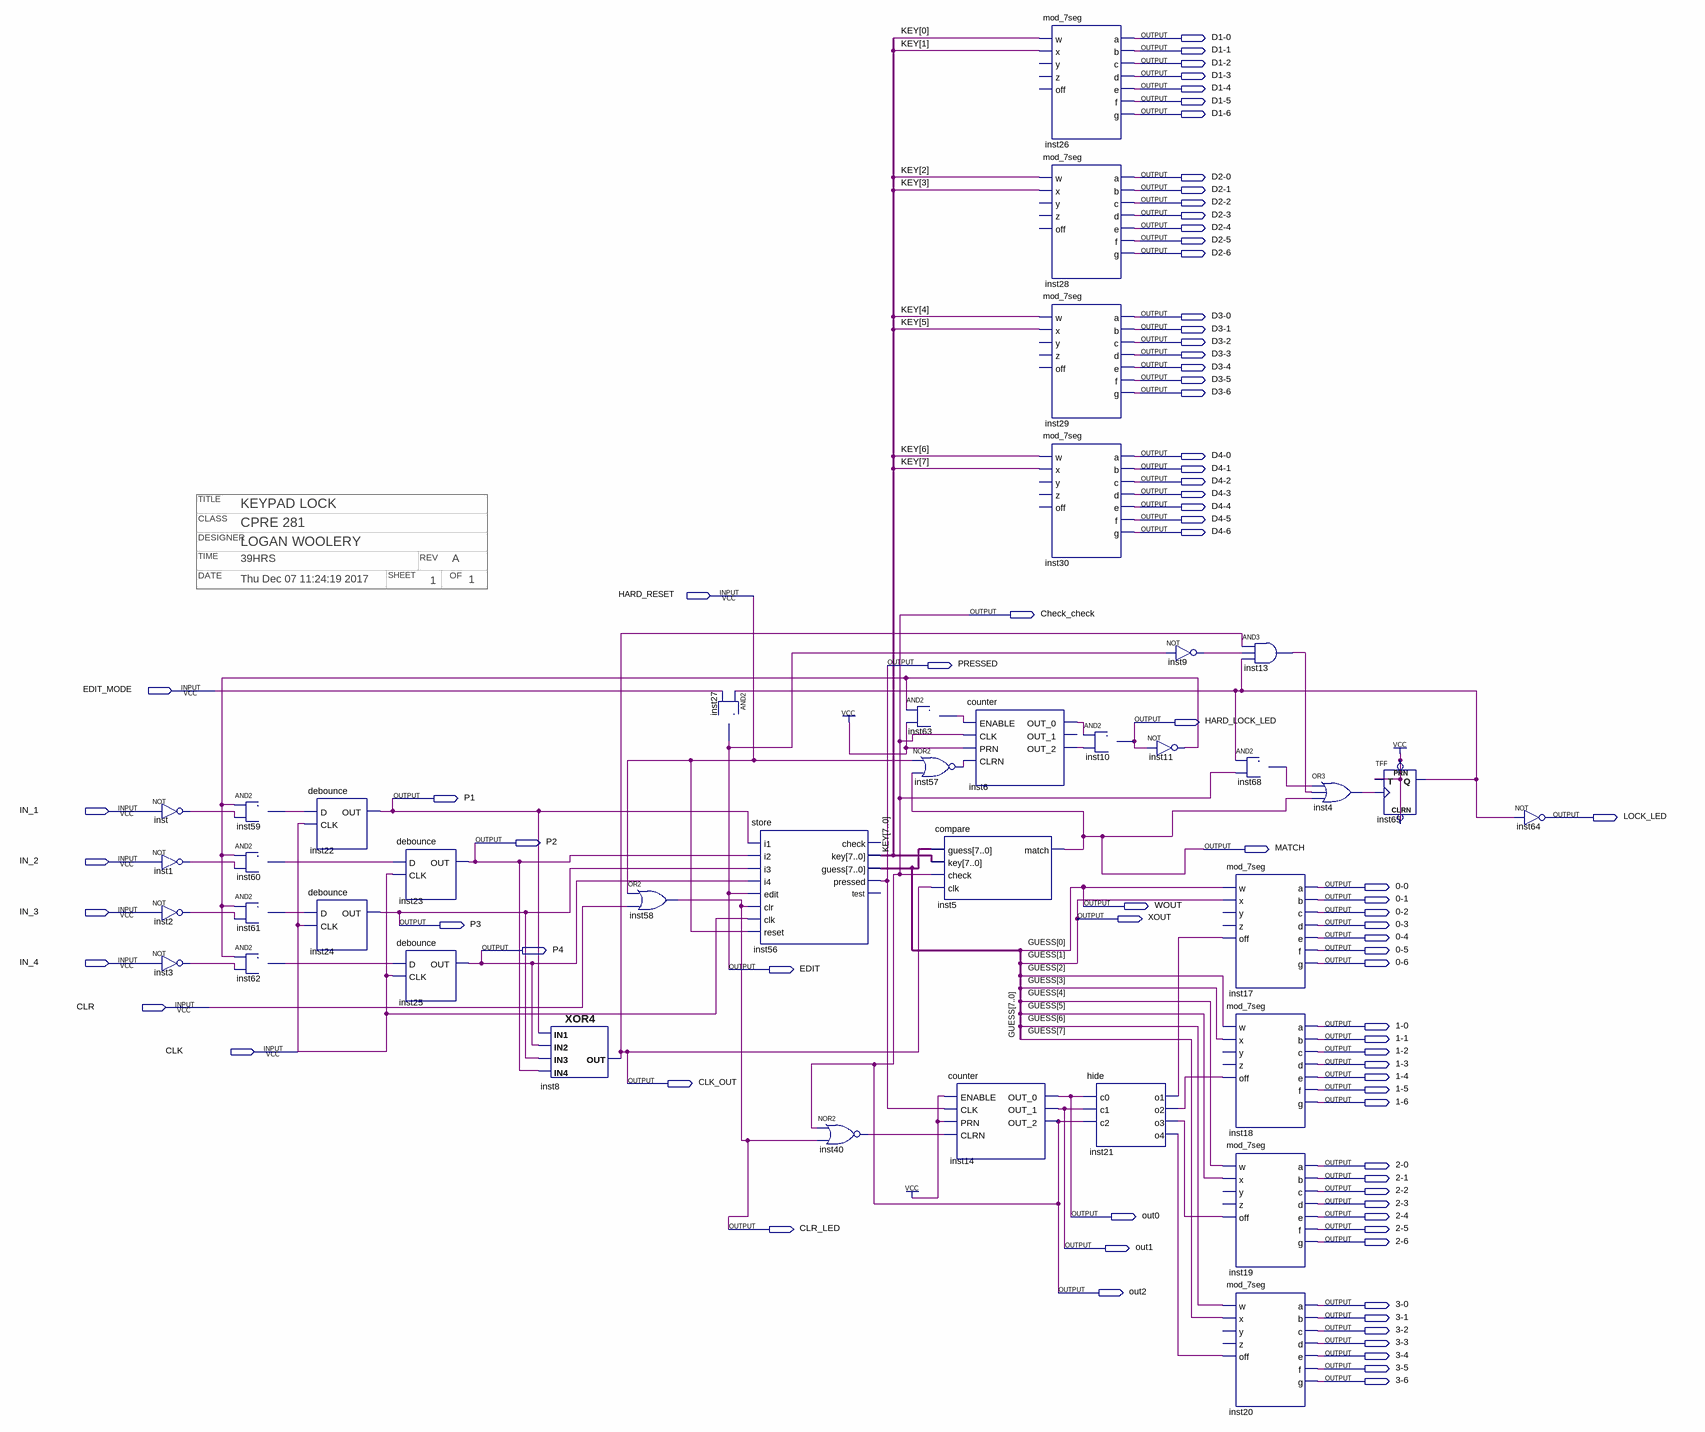
[diagram p0: schematic sheet]
// Quartus schematic round2.bdf as structural Verilog: 39 symbols, 81 pins
// Title block: CLASS: CPRE 281; DATE: Thu Dec 07 11:24:19 2017; DESIGNER: LOGAN WOOLERY; OF: 1; REV: A; SHEET: 1; TIME: 39HRS; TITLE: KEYPAD LOCK
module round2 (
  input  HARD_RESET,
  input  EDIT_MODE,
  input  IN_1,
  input  IN_2,
  input  IN_3,
  input  IN_4,
  input  CLR,
  input  CLK,
  output \D1-0 ,
  output \D1-1 ,
  output \D1-2 ,
  output \D1-3 ,
  output \D1-4 ,
  output \D1-5 ,
  output \D1-6 ,
  output \D2-0 ,
  output \D2-1 ,
  output \D2-2 ,
  output \D2-3 ,
  output \D2-4 ,
  output \D2-5 ,
  output \D2-6 ,
  output \D3-0 ,
  output \D3-1 ,
  output \D3-2 ,
  output \D3-3 ,
  output \D3-4 ,
  output \D3-5 ,
  output \D3-6 ,
  output \D4-0 ,
  output \D4-1 ,
  output \D4-2 ,
  output \D4-3 ,
  output \D4-4 ,
  output \D4-5 ,
  output \D4-6 ,
  output Check_check,
  output PRESSED,
  output HARD_LOCK_LED,
  output P1,
  output LOCK_LED,
  output P2,
  output MATCH,
  output \0-0 ,
  output \0-1 ,
  output WOUT,
  output \0-2 ,
  output XOUT,
  output P3,
  output \0-3 ,
  output \0-4 ,
  output P4,
  output \0-5 ,
  output \0-6 ,
  output EDIT,
  output \1-0 ,
  output \1-1 ,
  output \1-2 ,
  output \1-3 ,
  output \1-4 ,
  output CLK_OUT,
  output \1-5 ,
  output \1-6 ,
  output \2-0 ,
  output \2-1 ,
  output \2-2 ,
  output \2-3 ,
  output out0,
  output \2-4 ,
  output CLR_LED,
  output \2-5 ,
  output \2-6 ,
  output out1,
  output out2,
  output \3-0 ,
  output \3-1 ,
  output \3-2 ,
  output \3-3 ,
  output \3-4 ,
  output \3-5 ,
  output \3-6 
);

  wire inst1_out, inst2_out, inst3_out, inst4_out, inst6_out_0, inst6_out_2, inst9_out, inst11_out,
       inst13_out, inst21_o1, inst21_o2, inst21_o3, inst21_o4, inst40_out, inst57_out, inst59_out,
       inst60_out, inst61_out, inst62_out, inst63_out, inst65_q, inst68_out, inst_out;
  wire [7:0] KEY;
  wire [7:2] GUESS;

  not inst (inst_out, IN_1);
  not inst1 (inst1_out, IN_2);
  not inst2 (inst2_out, IN_3);
  not inst3 (inst3_out, IN_4);
  and inst59 (inst59_out, inst11_out, inst_out);
  and inst60 (inst60_out, inst11_out, inst1_out);
  and inst61 (inst61_out, inst11_out, inst2_out);
  and inst62 (inst62_out, inst11_out, inst3_out);
  debounce inst22 (.D(inst59_out), .CLK(CLK), .OUT(P1));
  debounce inst24 (.D(inst61_out), .CLK(CLK), .OUT(P3));
  debounce inst23 (.D(inst60_out), .CLK(CLK), .OUT(P2));
  debounce inst25 (.D(inst62_out), .CLK(CLK), .OUT(P4));
  XOR4 inst8 (.IN3(P3), .IN4(P2), .IN2(P4), .IN1(P1), .OUT(CLK_OUT));
  or inst58 (CLR_LED, HARD_RESET, CLR);
  and inst27 (EDIT, inst65_q, EDIT_MODE);
  store inst56 (
    .i1(P1), .i2(P2), .i3(P3), .i4(P4), .edit(EDIT), .clr(CLR_LED), .clk(CLK), .reset(HARD_RESET), .key(KEY),
    .guess({GUESS, XOUT, WOUT}), .pressed(PRESSED));  // open: check, test
  nor inst40 (inst40_out, Check_check, CLR_LED);
  and inst63 (inst63_out, inst11_out, 1'b1);
  nor inst57 (inst57_out, HARD_RESET, MATCH);
  compare inst5 (.guess({GUESS, XOUT, WOUT}), .key(KEY), .check(Check_check), .clk(CLK_OUT), .match(MATCH));
  counter inst14 (
    .ENABLE(1'b1), .PRN(1'b1), .CLK(PRESSED), .CLRN(inst40_out), .OUT_0(out0), .OUT_1(out1),
    .OUT_2(Check_check));
  counter inst6 (
    .ENABLE(inst63_out), .PRN(1'b1), .CLK(Check_check), .CLRN(inst57_out), .OUT_0(inst6_out_0),
    .OUT_2(inst6_out_2));  // open: OUT_1
  mod_7seg inst26 (
    .w(KEY[0]), .x(KEY[1]), .a(\D1-0 ), .b(\D1-1 ), .c(\D1-2 ), .d(\D1-3 ), .e(\D1-4 ), .f(\D1-5 ), .g(\D1-6 ));  // open: y, z, off
  mod_7seg inst28 (
    .w(KEY[2]), .x(KEY[3]), .a(\D2-0 ), .b(\D2-1 ), .c(\D2-2 ), .d(\D2-3 ), .e(\D2-4 ), .f(\D2-5 ), .g(\D2-6 ));  // open: y, z, off
  mod_7seg inst29 (
    .w(KEY[4]), .x(KEY[5]), .a(\D3-0 ), .b(\D3-1 ), .c(\D3-2 ), .d(\D3-3 ), .e(\D3-4 ), .f(\D3-5 ), .g(\D3-6 ));  // open: y, z, off
  mod_7seg inst30 (
    .w(KEY[6]), .x(KEY[7]), .a(\D4-0 ), .b(\D4-1 ), .c(\D4-2 ), .d(\D4-3 ), .e(\D4-4 ), .f(\D4-5 ), .g(\D4-6 ));  // open: y, z, off
  and inst10 (HARD_LOCK_LED, inst6_out_0, inst6_out_2);
  hide inst21 (.c0(out0), .c1(out1), .c2(Check_check), .o1(inst21_o1), .o2(inst21_o2), .o3(inst21_o3), .o4(inst21_o4));
  not inst11 (inst11_out, HARD_LOCK_LED);
  not inst9 (inst9_out, EDIT);
  and inst13 (inst13_out, CLK_OUT, inst9_out, inst65_q);
  and inst68 (inst68_out, inst65_q, Check_check);
  mod_7seg inst17 (
    .w(WOUT), .x(XOUT), .off(inst21_o1), .a(\0-0 ), .b(\0-1 ), .c(\0-2 ), .d(\0-3 ), .e(\0-4 ), .f(\0-5 ),
    .g(\0-6 ));  // open: y, z
  mod_7seg inst18 (
    .w(GUESS[2]), .x(GUESS[3]), .off(inst21_o2), .a(\1-0 ), .b(\1-1 ), .c(\1-2 ), .d(\1-3 ), .e(\1-4 ),
    .f(\1-5 ), .g(\1-6 ));  // open: y, z
  mod_7seg inst19 (
    .w(GUESS[4]), .x(GUESS[5]), .off(inst21_o3), .a(\2-0 ), .b(\2-1 ), .c(\2-2 ), .d(\2-3 ), .e(\2-4 ),
    .f(\2-5 ), .g(\2-6 ));  // open: y, z
  mod_7seg inst20 (
    .w(GUESS[6]), .x(GUESS[7]), .off(inst21_o4), .a(\3-0 ), .b(\3-1 ), .c(\3-2 ), .d(\3-3 ), .e(\3-4 ),
    .f(\3-5 ), .g(\3-6 ));  // open: y, z
  or inst4 (inst4_out, inst68_out, inst13_out, MATCH);
  TFF inst65 (.PRN(1'b1), .CLRN(1'b1), .T(1'b1), .CLK(inst4_out), .Q(inst65_q));
  not inst64 (LOCK_LED, inst65_q);

  assign out2 = Check_check;

  // Other names for the same wires on the sheet: GUESS[1:0] = {XOUT, WOUT}
endmodule
